# Altium schematic sheet buck_converter.SchDoc: Buck-Converter
size A4; SheetNumber: 2; SheetTotal: 4
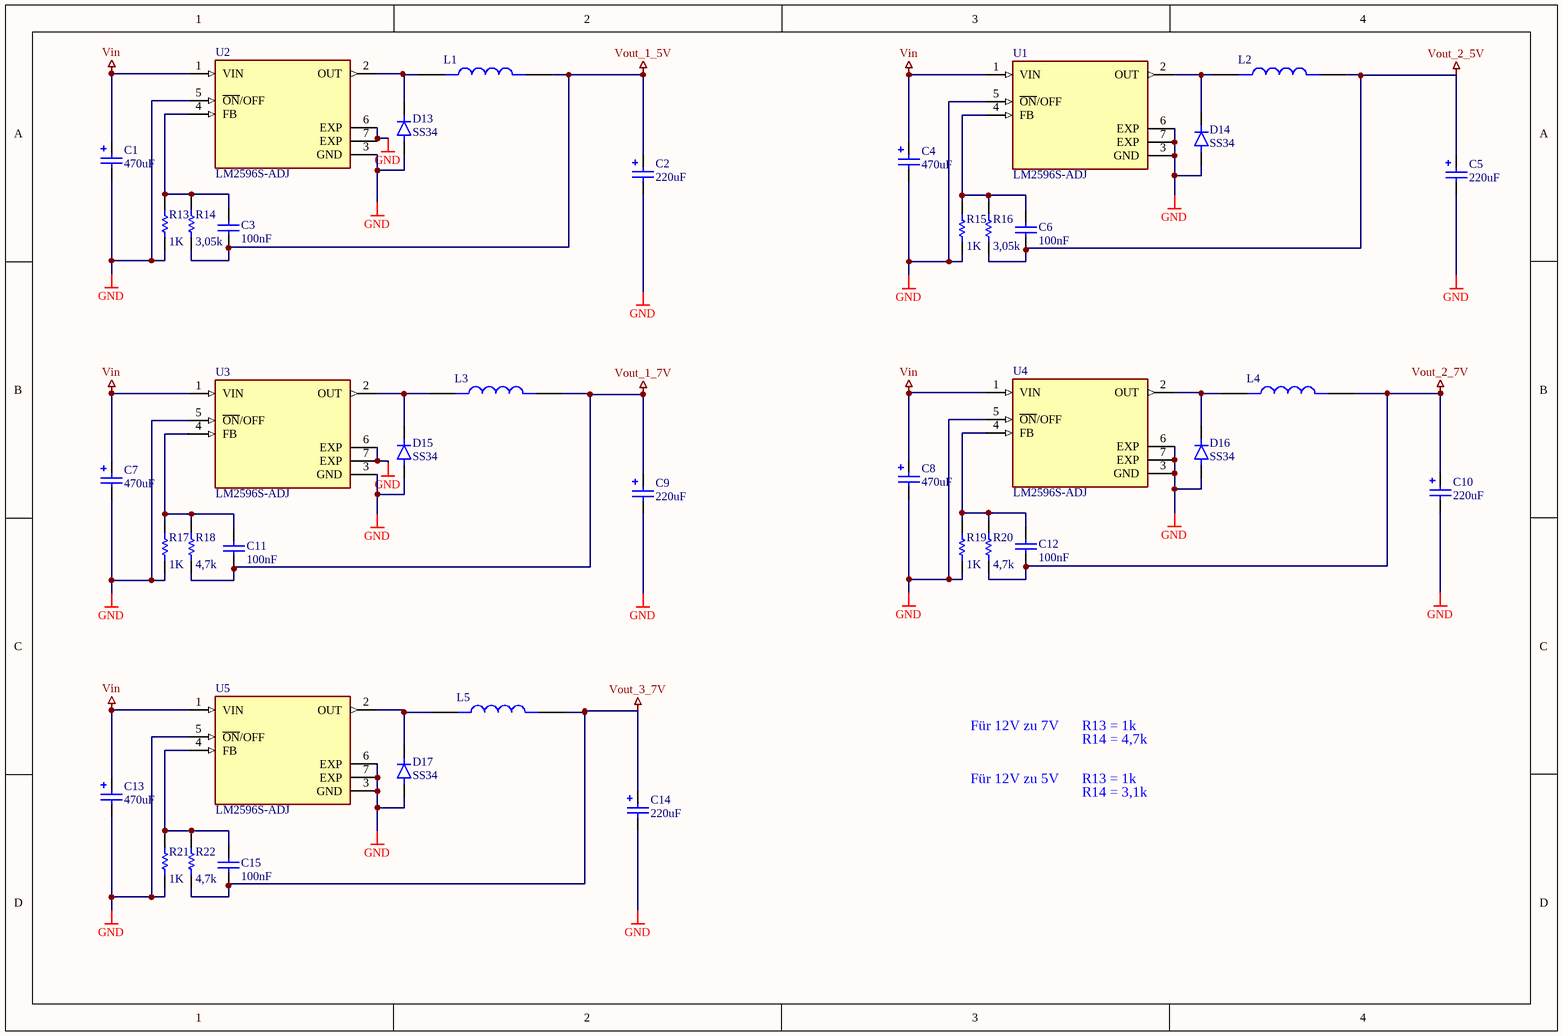
[diagram p0: buck_converter.SchDoc]

## Parts
C1  value 470uF  [CAP_EEEFK1H471AM]  (hidden comment: Cap)
C2  value 220uF  [CAPAE1030X1080N_UWT1H221MNL1GS]  (hidden comment: Cap)
C3  value 100nF  [RES_ERJB3CFR15V]  (hidden comment: Cap)
C4  value 470uF  [CAP_EEEFK1H471AM]  (hidden comment: Cap)
C5  value 220uF  [CAPAE1030X1080N_UWT1H221MNL1GS]  (hidden comment: Cap)
C6  value 100nF  [RES_ERJB3CFR15V]  (hidden comment: Cap)
C7  value 470uF  [CAP_EEEFK1H471AM]  (hidden comment: Cap)
C8  value 470uF  [CAP_EEEFK1H471AM]  (hidden comment: Cap)
C9  value 220uF  [CAPAE1030X1080N_UWT1H221MNL1GS]  (hidden comment: Cap)
C10  value 220uF  [CAPAE1030X1080N_UWT1H221MNL1GS]  (hidden comment: Cap)
C11  value 100nF  [RES_ERJB3CFR15V]  (hidden comment: Cap)
C12  value 100nF  [RES_ERJB3CFR15V]  (hidden comment: Cap)
C13  value 470uF  [CAP_EEEFK1H471AM]  (hidden comment: Cap)
C14  value 220uF  [CAPAE1030X1080N_UWT1H221MNL1GS]  (hidden comment: Cap)
C15  value 100nF  [RES_ERJB3CFR15V]  (hidden comment: Cap)
D13  SS34  [DIOMELF3414N]
D14  SS34  [DIOMELF3414N]
D15  SS34  [DIOMELF3414N]
D16  SS34  [DIOMELF3414N]
D17  SS34  [DIOMELF3414N]
L1  MLF2012C680KT000  [IND_SRN6045TA-680M]  (value not drawn)
L2  MLF2012C680KT000  [IND_SRN6045TA-680M]  (value not drawn)
L3  MLF2012C680KT000  [IND_SRN6045TA-680M]  (value not drawn)
L4  MLF2012C680KT000  [IND_SRN6045TA-680M]  (value not drawn)
L5  MLF2012C680KT000  [IND_SRN6045TA-680M]  (value not drawn)
R13  value 1K  [RES_ERJB3CFR15V]  (hidden comment: Res1)
R14  value 3,05k  [RES_ERJB3CFR15V]  (hidden comment: Res1)
R15  value 1K  [RES_ERJB3CFR15V]  (hidden comment: Res1)
R16  value 3,05k  [RES_ERJB3CFR15V]  (hidden comment: Res1)
R17  value 1K  [RES_ERJB3CFR15V]  (hidden comment: Res1)
R18  value 4,7k  [RES_ERJB3CFR15V]  (hidden comment: Res1)
R19  value 1K  [RES_ERJB3CFR15V]  (hidden comment: Res1)
R20  value 4,7k  [RES_ERJB3CFR15V]  (hidden comment: Res1)
R21  value 1K  [RES_ERJB3CFR15V]  (hidden comment: Res1)
R22  value 4,7k  [RES_ERJB3CFR15V]  (hidden comment: Res1)
U1  LM2596S-ADJ  [VREG_LM2596SX-5.0_NOPB]
U2  LM2596S-ADJ  [VREG_LM2596SX-5.0_NOPB]
U3  LM2596S-ADJ  [VREG_LM2596SX-5.0_NOPB]
U4  LM2596S-ADJ  [VREG_LM2596SX-5.0_NOPB]
U5  LM2596S-ADJ  [VREG_LM2596SX-5.0_NOPB]

## Nets
GND: C1.2 C2.2 C4.2 C5.2 C7.2 C8.2 C9.2 C10.2 C13.2 C14.2 D13.A D14.A D15.A D16.A D17.A R13.1 R15.1 R17.1 R19.1 R21.1 U1.3(GND) U1.5(~{ON}/OFF) U1.6(EXP) U1.7(EXP) U2.3(GND) U2.5(~{ON}/OFF) U2.6(EXP) U2.7(EXP) U3.3(GND) U3.5(~{ON}/OFF) U3.6(EXP) U3.7(EXP) U4.3(GND) U4.5(~{ON}/OFF) U4.6(EXP) U4.7(EXP) U5.3(GND) U5.5(~{ON}/OFF) U5.6(EXP) U5.7(EXP)
Vin: C1.1 C4.1 C7.1 C8.1 C13.1 U1.1(VIN) U2.1(VIN) U3.1(VIN) U4.1(VIN) U5.1(VIN)
Vout_1_5V: C2.1 C3.2 L1.2 R14.1
Vout_1_7V: C9.1 C11.2 L3.2 R18.1
Vout_2_5V: C5.1 C6.2 L2.2 R16.1
Vout_2_7V: C10.1 C12.2 L4.2 R20.1
Vout_3_7V: C14.1 C15.2 L5.2 R22.1
NetC3_1: C3.1 R13.2 R14.2 U2.4(FB)
NetC6_1: C6.1 R15.2 R16.2 U1.4(FB)
NetC11_1: C11.1 R17.2 R18.2 U3.4(FB)
NetC12_1: C12.1 R19.2 R20.2 U4.4(FB)
NetC15_1: C15.1 R21.2 R22.2 U5.4(FB)
NetD13_C: D13.C L1.1 U2.2(OUT)
NetD14_C: D14.C L2.1 U1.2(OUT)
NetD15_C: D15.C L3.1 U3.2(OUT)
NetD16_C: D16.C L4.1 U4.2(OUT)
NetD17_C: D17.C L5.1 U5.2(OUT)

## Notes on the sheet
- Für 12V zu 7V
- R13 = 1k
- Für 12V zu 5V
- R14 = 4,7k
- R14 = 3,1k

## Library data of the parts
C1 C2 C4 C5 C7-C10 C13 C14 = ELKO
C3 C6 C11 C12 C15 = KO: Kondensator
D13-D17 = FDLL4148: Diode Standard 100 V 200mA Surface Mount SOD-80; MF: ON Semiconductor; SnapEDA_Link: https://www.snapeda.com/parts/FDLL4148/Onsemi/view-part/?ref=snap; Package: SOD-80-2 ON Semiconductor; Value: *; MP: FDLL4148; Check_prices: https://www.snapeda.com/parts/FDLL4148/Onsemi/view-part/?ref=eda
L1-L5 = MLF2012C680KT000: 68ÂµH Shielded Multilayer Inductor 2mA 2.9Ohm Max 0805 (2012 Metric); MF: {'manufacturer': u'TDK Corporation'}; Package: None; Price: None; Value: *; MP: MLF2012C680KT000; Availability: Unavailable
R13-R22 = Res1: Resistor; Published: 8-Jun-2000; LatestRevisionDate: 17-Jul-2002; LatestRevisionNote: Re-released for DXP Platform.; PackageReference: AXIAL-0.3; Publisher: Altium Limited; PackageDescription: Axial Device, Thru-Hole; 2 Leads; 0.3 in Pin Spacing
U1-U5 = LM2596S-3.3: SIMPLE SWITCHERÂ® 4.5V to 40V, 3A Low Component Count Step-Down Regulator 5-DDPAK/TO-263; MF: Texas Instruments; SnapEDA_Link: https://www.snapeda.com/parts/LM2596S-3.3/Texas+Instruments/view-part/?ref=snap; Package: TO-263-5 Texas Instruments; Value: *; MP: LM2596S-3.3; Check_prices: https://www.snapeda.com/parts/LM2596S-3.3/Texas+Instruments/view-part/?ref=eda